# EasyEDA Pro project Board.eprj, schematic Schematic2
Create Date: 2024-07-30; Page Name: P1; Project Name: Dami; Schematic Name: Schematic2; Update Date: 2024-08-01; Company: EasyEDA.com; Drawn: EasyEDA; Page Size: A4; Part Number: JLCPCB-002; Reviewed: EasyEDA; Version: V0.1
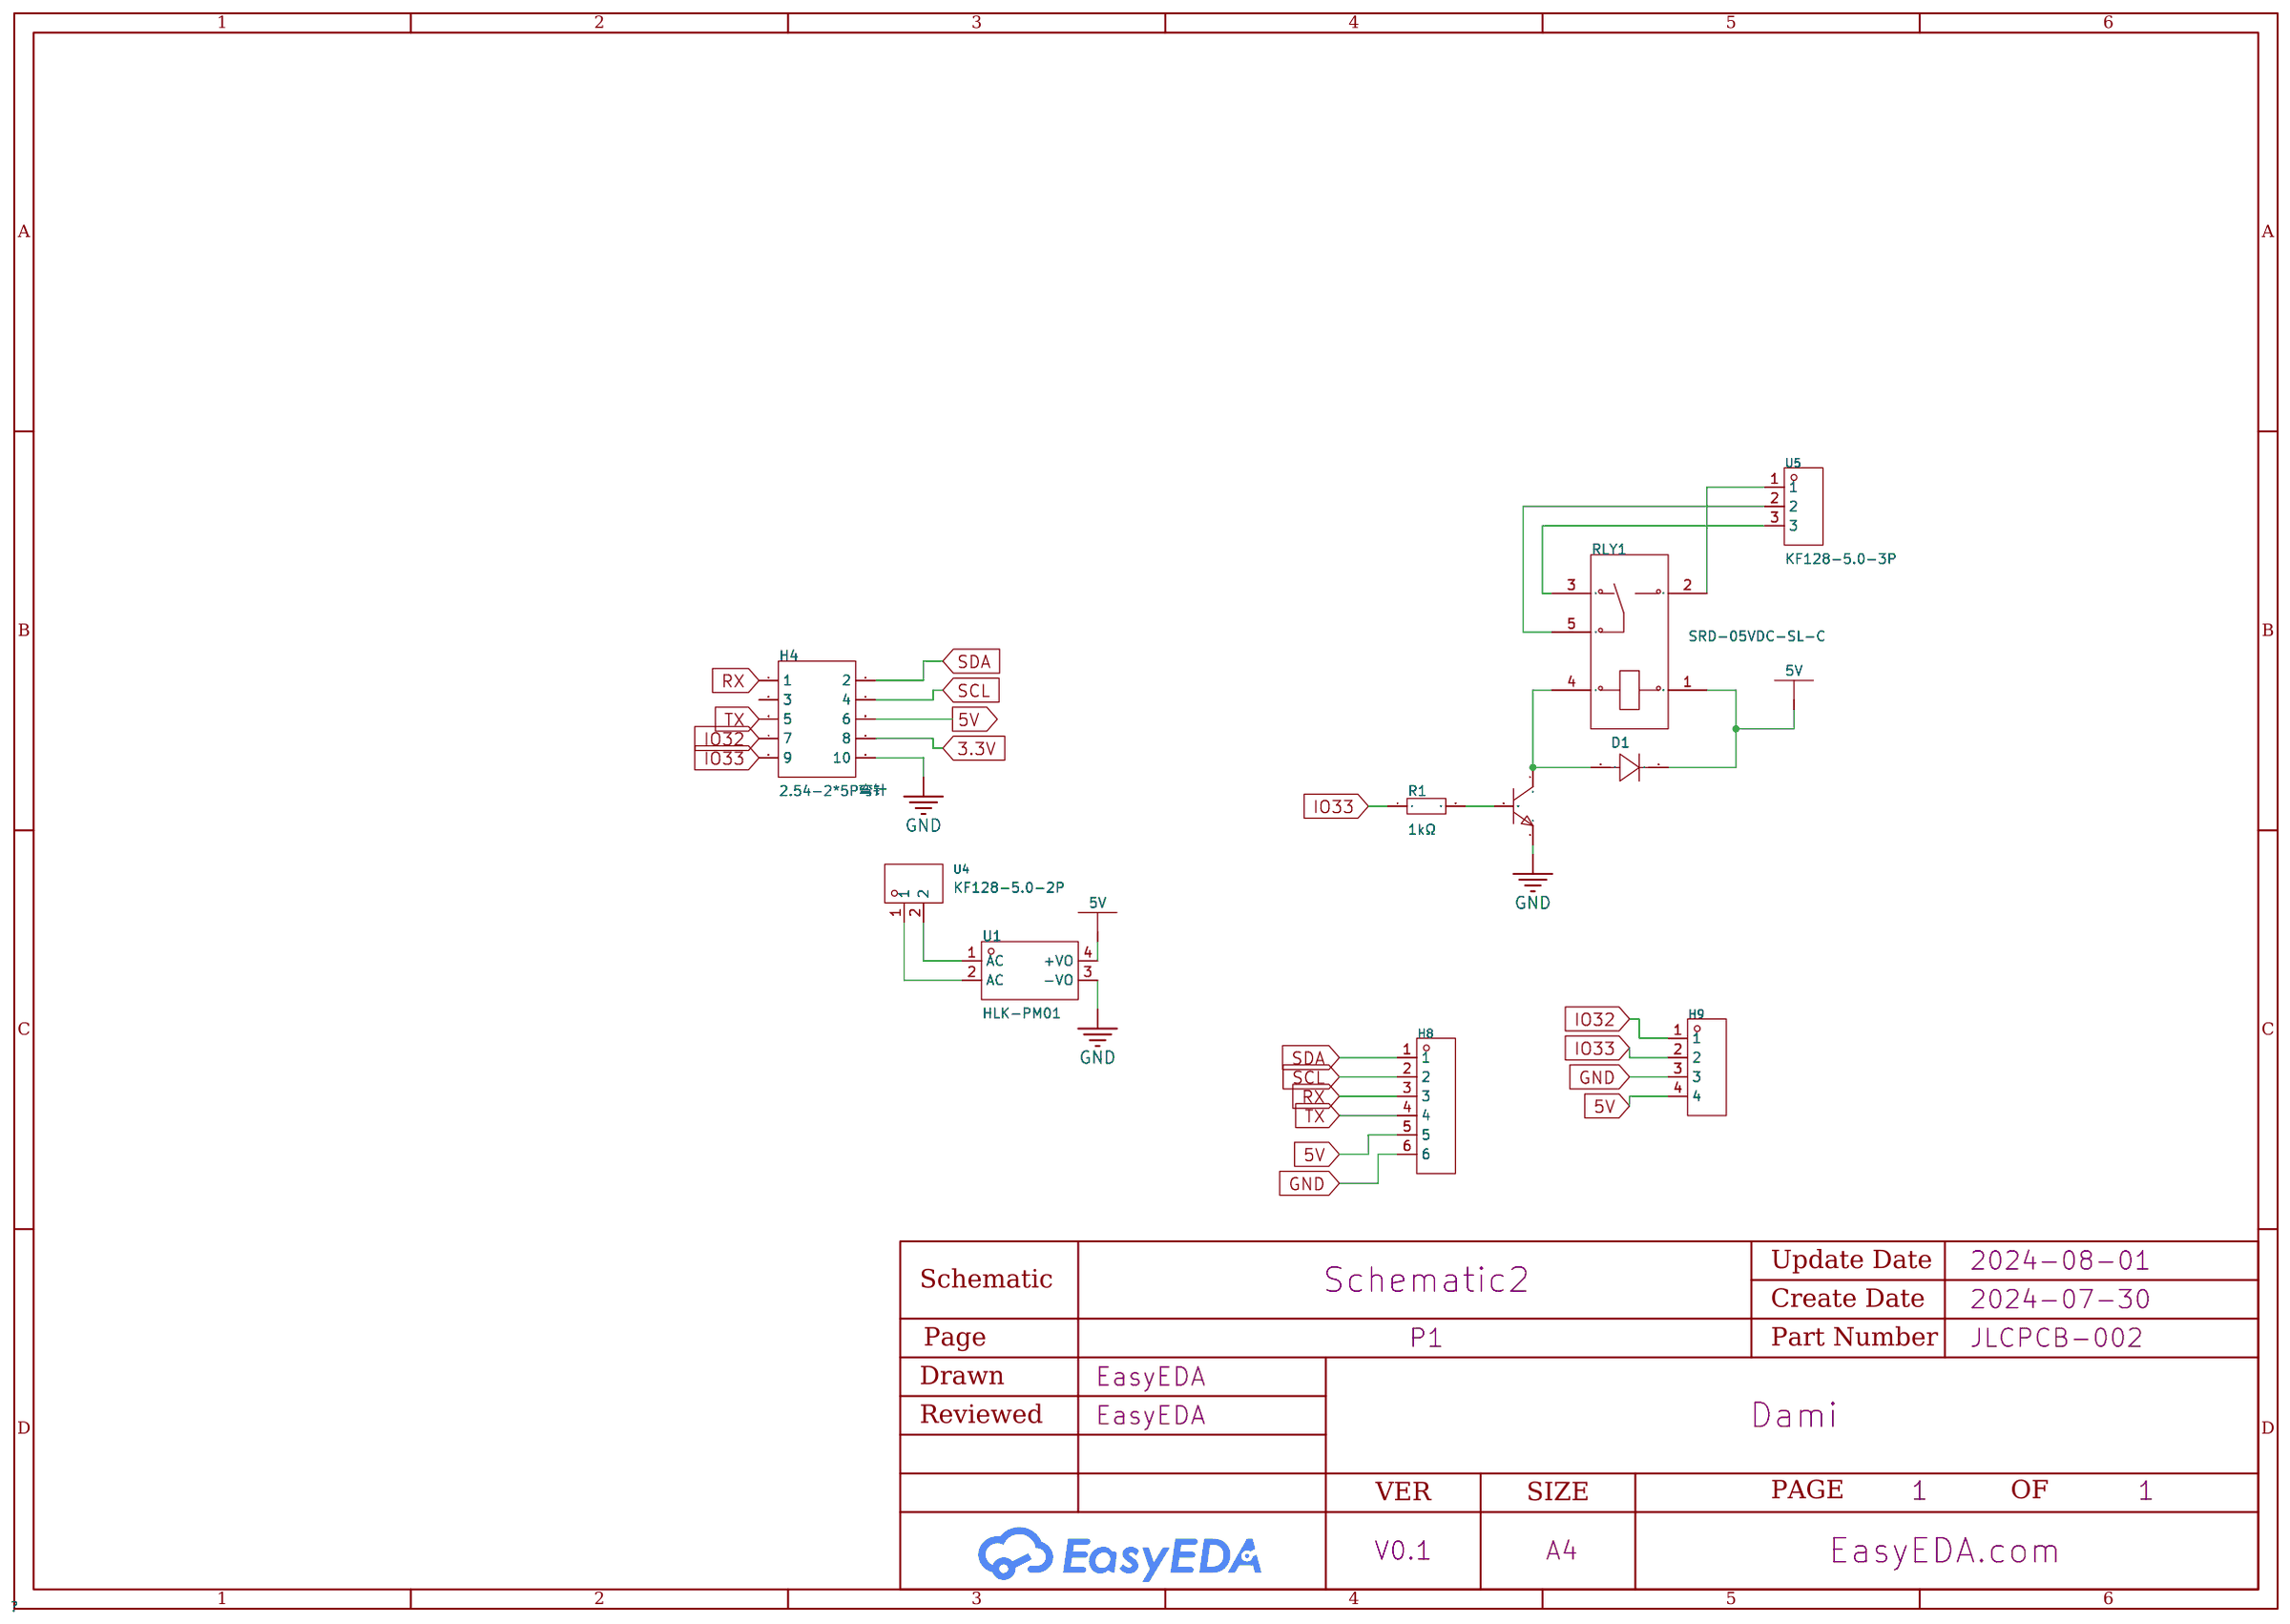
[diagram p1: schematic sheet]

## Parts
D1  -  [DO-41_BD2.4-L4.7-P8.70-D0.9-RD]
H4  2.54-2*5P弯针  [HDR-TH_10P-P2.54-H-M-R2-C5-S2.54-W12.9]
H8  -  [HDR-TH_6P-P2.54-V-F]
H9  -  [HDR-TH_4P-P2.54-V-F]
Q2  BC548  [TO-92-3_L4.9-W3.7-P1.27-L]
R1  1kΩ  [RES-TH_BD1.8-L3.2-P7.20-D0.4]
RLY1  SRD-05VDC-SL-C  [RELAY-TH_SRD-XXVDC-XL-C]
U1  HLK-PM01  [PWRM-TH_HLK-PM01]
U4  KF128-5.0-2P  [CONN-TH_P5.00_KF128-5.0-2P]
U5  KF128-5.0-3P  [CONN-TH_3P-P5.00_KF128-5.0-3P]

## Library data of the parts
D1 = 1N4007: Supplier Footprint: DO-41
H4 = 2.54-2*5P弯针: Pin Structure:2x5P Pitch:2.54mm Row Spacing:2.54mm Circluar Pins/Square Pins:Square Pins Mounting Type:Right-Angle Number of Rows:双排 Number of Pins:10P Current Rating (Max):3A Voltage Rating (Max):- Length of Mating Pin:6mm Insulation Height:2.54mm Contac; LCSC Part Name: 间距:2.54mm 2x5P 弯插 方针; Supplier Part: C60563; Manufacturer: BOOMELE(博穆精密); Supplier Footprint: 弯插,P=2.54mm; JLCPCB Part Class: Extended Part; Datasheet: https://atta.szlcsc.com/upload/public/pdf/source/20201009/C60563_5FFC87C912161176506B1BF1C101B88D.pdf; Supplier: LCSC; Pin Structure: 2x5P; Pitch: 2.54mm; Row Spacing: 2.54mm; Circluar Pins/Square Pins: Square Pins; Mounting Type: Right-Angle; Number of Rows: 双排; Number of Pins: 10P; Current Rating (Max): 3A; Length of Mating Pin: 6mm; Insulation Height: 2.54mm; Operating Temperature Range: -55℃~+105℃; Color: Black
H8 = HDR-F_2.54_1x6P: Supplier Footprint: Through
H9 = HDR-F_2.54_1x4P: Supplier Footprint: Through
Q2 = BC548: Transistor Type: Collector Current (Ic): Collector-Emitter Breakdown Voltage (Vceo): Power Dissipation (Pd): DC Current Gain (hFE@Ic,Vce):200@2mA,5V DC Current Gain (hFE@Ic,Vce):200@2mA,5V Transition Frequency (fT):150MHz Collector Cut-Off Current (Icbo):; LCSC Part Name: BC548(RANGE:200-450) B档(200~450); Supplier Part: C36611; Manufacturer: CJ(江苏长电/长晶); Supplier Footprint: TO-92-3; JLCPCB Part Class: Extended Part; Datasheet: https://atta.szlcsc.com/upload/public/pdf/source/20140924/1457707240501.pdf; Supplier: LCSC; DC Current Gain (hFE@Ic,Vce): 200@2mA,5V; Transition Frequency (fT): 150MHz; Collector Cut-Off Current (Icbo): 100nA; Collector-Emitter Saturation Voltage (VCE(sat)@Ic,Ib): 300mV@100mA,5mA
R1 = Res_AXIAL-1/8W: Supplier Footprint: Through
RLY1 = SRD-05VDC-SL-C: Coil Voltage:5V Contact Form:一组转换:1C(SPDT-转换) Pin Number:5 Contact Rating:- Maximum Switching Voltage:250V@AC Coil Rated Power:360mW Maximum Switching Current:15A Coil Type:无极性-单线圈 Coil Resistance:70Ω Contact Resistance:100mΩ Operate Time:10ms Release Tim; LCSC Part Name: 蓝色; Supplier Part: C35449; Manufacturer: 松乐; Supplier Footprint: 插件,15.6x19.2mm; JLCPCB Part Class: Extended Part; Datasheet: https://atta.szlcsc.com/upload/public/pdf/source/20200305/C490149_C96E4098A3B1FFB377D5AD2E40B7C2A8.pdf; Supplier: LCSC; Coil Voltage: 5V; Contact Form: 一组转换:1C(SPDT-转换); Pin Number: 5; Maximum Switching Voltage: 250V@AC; Coil Rated Power: 360mW; Maximum Switching Current: 15A; Coil Type: 无极性-单线圈; Coil Resistance: 70Ω; Contact Resistance: 100mΩ; Operate Time: 10ms; Release Time: 10ms
U1 = HLK-PM01: Supplier Part: C209903; Manufacturer: HI-LINK(海凌科); Supplier Footprint: 插件; Datasheet: https://atta.szlcsc.com/upload/public/pdf/source/20220421/8C2E290B3E1C64DAE99DB0B33492E42C.pdf; Supplier: LCSC
U4 = KF128-5.0-2P: Structure:1x2P Pitch:5mm Color:Green Mounting Style:Straight Current Rating (Max):24A Voltage Rating (Max):250V Number of Pins:2P Number of Rows:1 Wire Gauge - AWG:12~22 Wire Gauge - AWG:12~22 Wire Gauge - mm2:2.5 Wire Gauge - mm2:2.5 Number of PINs Per R; LCSC Part Name: 5mm 1x2P 排数:1 每排P数:2 直插; Supplier Part: C474950; Manufacturer: KEFA(科发); Supplier Footprint: 插件,P=5mm; JLCPCB Part Class: Extended Part; Datasheet: https://atta.szlcsc.com/upload/public/pdf/source/20230317/B8CD42C0E3A38C01CD877E6842427715.pdf; Supplier: LCSC; Structure: 1x2P; Pitch: 5mm; Color: Green; Mounting Style: Straight; Current Rating (Max): 24A; Voltage Rating (Max): 250V; Number of Pins: 2P; Number of Rows: 1; Wire Gauge - AWG: 12~22; Wire Gauge - mm2: 2.5; Number of PINs Per Row: 2; Operating Temperature Range: -40℃~+105℃
U5 = KF128-5.0-3P: Structure:1x3P Pitch:5mm Color:Green Mounting Style:Straight Current Rating (Max):24A Voltage Rating (Max):250V Number of Pins:3P Number of Rows:1 Wire Gauge - AWG:12~22 Wire Gauge - AWG:12~22 Wire Gauge - mm2:2.5 Wire Gauge - mm2:2.5 Number of PINs Per R; LCSC Part Name: 5mm 1x3P 排数:1 每排P数:3 直插; Supplier Part: C474951; Manufacturer: KEFA(科发); Supplier Footprint: 插件,P=5mm; Datasheet: https://atta.szlcsc.com/upload/public/pdf/source/20230317/B8CD42C0E3A38C01CD877E6842427715.pdf; Supplier: LCSC; Structure: 1x3P; Pitch: 5mm; Color: Green; Mounting Style: Straight; Current Rating (Max): 24A; Voltage Rating (Max): 250V; Number of Pins: 3P; Number of Rows: 1; Wire Gauge - AWG: 12~22; Wire Gauge - mm2: 2.5; Number of PINs Per Row: 3; Operating Temperature Range: -40℃~+105℃

## Nets
3.3V: H4.8
5V: D1.1(K) H4.6 H8.5 H9.4 RLY1.1 U1.4(+VO)
GND: H4.10 H8.6 H9.3 Q2.3(E) U1.3(-VO)
IO32: H4.7 H9.1
IO33: H4.9 H9.2 R1.1
RX: H4.1 H8.3
SCL: H4.4 H8.2
SDA: H4.2 H8.1
TX: H4.5 H8.4
$1N407: RLY1.3 U5.3
$1N669: Q2.2(B) R1.2
$1N719: U1.1(AC) U4.2
$1N726: U1.2(AC) U4.1
$1N778: RLY1.5 U5.2
$1N787: RLY1.2 U5.1
$1N2276: D1.2(A) Q2.1(C) RLY1.4

Not connected (* = marked no-connect by the designer): H4 3
